# Altium schematic sheet PLC1_2.SchDoc
size 420 x 297 mm; SheetNumber: 2; Scale: {Масш.}; Title1str: {Наименование}; PageSetup: Record=PageOptions|CenterHorizontal=False|CenterVertical=False|PrintScale=0.70|XCorrection=0.00|YCorrection=0.00|PrintKind=1|BorderSize=5000000|LeftOffset=0|BottomOffset=0|Orientation=2|PaperLength=1000|PaperWidth=1000|Scale=100|PaperSource=7|PrintQuality=600|MediaType=1|DitherType=10|PrintScaleMode=1|PaperKind=A4; Title2str: {Наименование}; ProcessInspection: {Т.контр.}; Mass: {Масса}; NormInspection: {Н.контр.}; EngineerName: {Инженер}; Letter1Column: {}; Letter2Column: {}; Letter3Column: {}; DocumentType: ?????????????? ?????; DocumentType1str: {Документ}; DocumentType2str: {Документ}
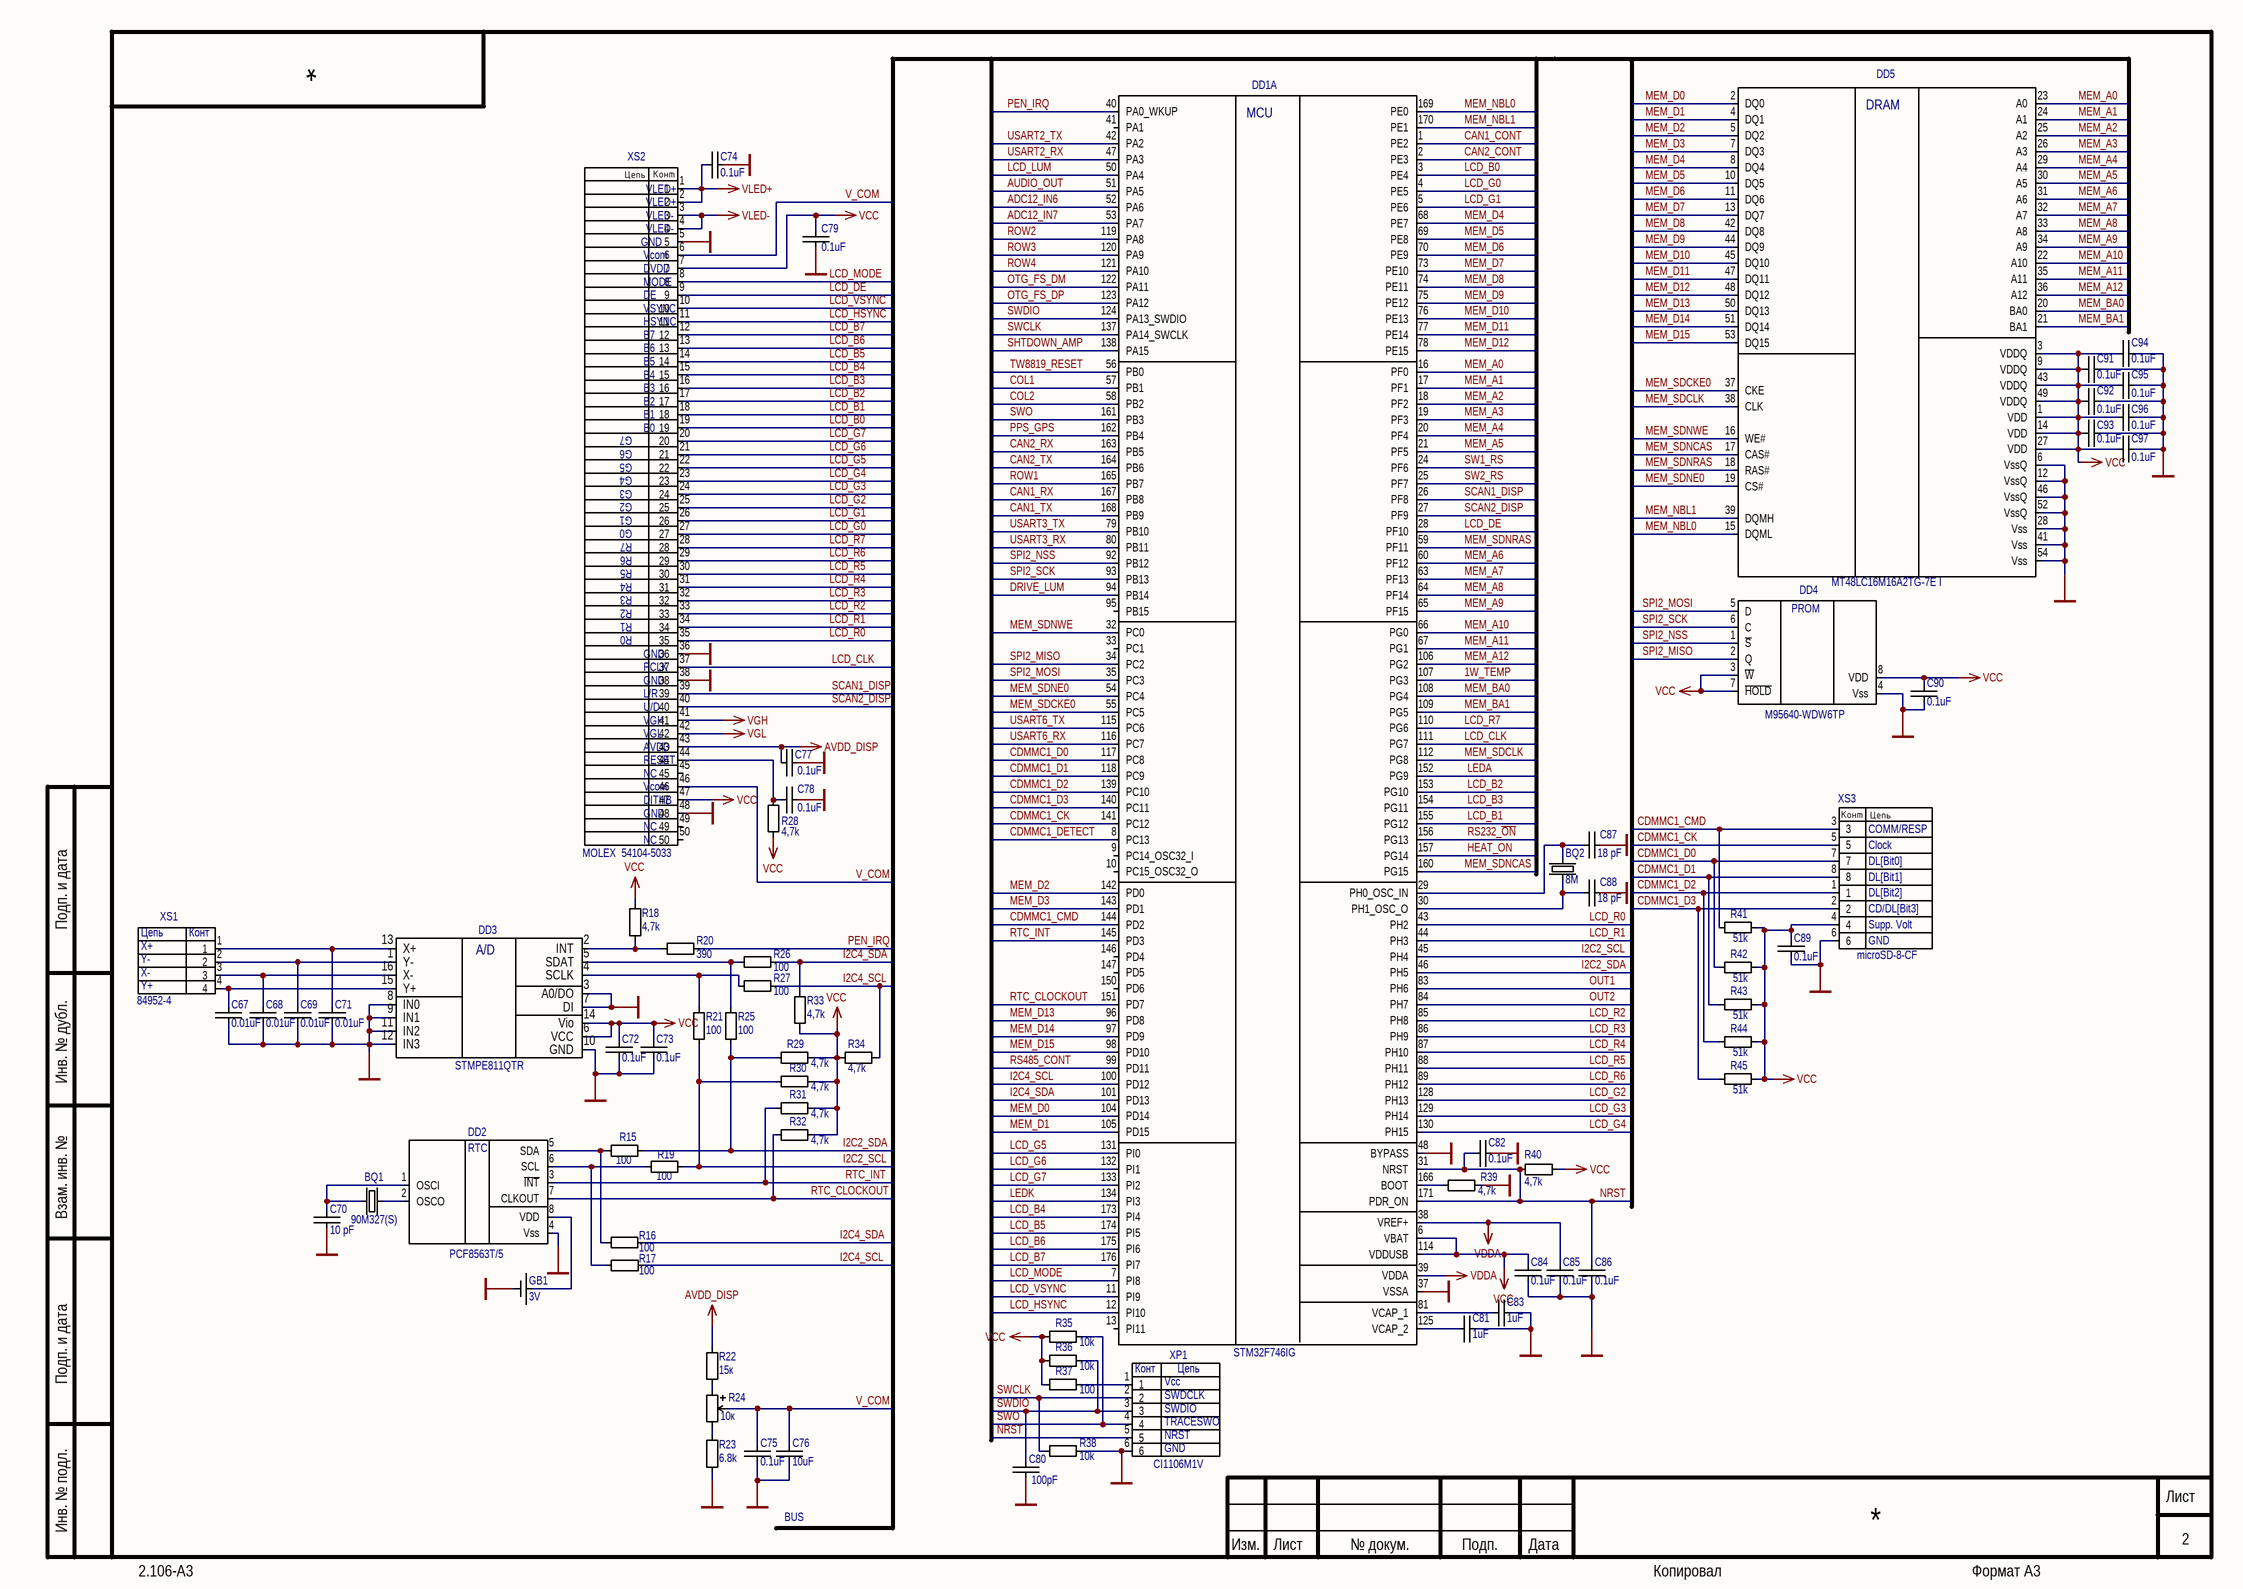
[diagram p0: PLC1_2.SchDoc]

## Parts
BQ1  Part Number: 90M327(S)  [90SMX]  (hidden comment: 90SMX 32768)
BQ2  value 8M  [TSX-3225]  (hidden comment: TSX-3225)
C67  0.01uF  [CAP_0603]
C68  0.01uF  [CAP_0603]
C69  0.01uF  [CAP_0603]
C70  value 10 pF  [CAP_0603]  (hidden comment: 10pF)
C71  0.01uF  [CAP_0603]
C72  0.1uF  [CAP_0603]
C73  0.1uF  [CAP_0603]
C74  0.1uF  [CAP_0603]
C75  0.1uF  [CAP_0603]
C76  value 10uF  [C_0805]  (hidden comment: Cap_0805)
C77  0.1uF  [CAP_0603]
C78  0.1uF  [CAP_0603]
C79  0.1uF  [CAP_0603]
C80  value 100pF  [CAP_0603]  (hidden comment: 100p)
C81  1uF  [CAP_0603]
C82  0.1uF  [CAP_0603]
C83  1uF  [CAP_0603]
C84  0.1uF  [CAP_0603]
C85  0.1uF  [CAP_0603]
C86  0.1uF  [CAP_0603]
C87  value 18 pF  [CAP_0603]  (hidden comment: 18pF)
C88  value 18 pF  [CAP_0603]  (hidden comment: 18pF)
C89  0.1uF  [CAP_0603]
C90  0.1uF  [CAP_0603]
C91  0.1uF  [CAP_0603]
C92  0.1uF  [CAP_0603]
C93  0.1uF  [CAP_0603]
C94  0.1uF  [CAP_0603]
C95  0.1uF  [CAP_0603]
C96  0.1uF  [CAP_0603]
C97  0.1uF  [CAP_0603]
DD1  Part Number: STM32F746IG  [F-QFP24x24-G176/N]  (hidden comment: STM32F746ZG_176)  (part A of 2)
DD2  Part Number: PCF8563T/5  [SOIC8]  (hidden comment: PCF8563_SOIC8)
DD3  STMPE811QTR  [QFN3X3-16]
DD4  Part Number: M95640-WDW6TP  [TSSO3x5-G8/X.4]  (hidden comment: M95640-WDW6TP_TSSOP-8)
DD5  Part Number: MT48LC16M16A2TG-7E I  [TSOP-54]  (hidden comment: MT48LC16M16A2TG)
GB1  3V  [Keystone-1066]
R15  value 100  [RES_0402]  (hidden comment: Res_0402)
R16  value 100  [RES_0402]  (hidden comment: Res_0402)
R17  value 100  [RES_0402]  (hidden comment: Res_0402)
R18  4,7k  [Res_0603]
R19  value 100  [RES_0402]  (hidden comment: Res_0402)
R20  390  [RES_0603]
R21  value 100  [RES_0402]  (hidden comment: Res_0402)
R22  15к  [RES_0603]
R23  6.8k  [RES_0603]
R24  value 10к  [3302X -3-103E]
R25  value 100  [RES_0402]  (hidden comment: Res_0402)
R26  value 100  [RES_0402]  (hidden comment: Res_0402)
R27  value 100  [RES_0402]  (hidden comment: Res_0402)
R28  4,7k  [Res_0603]
R29  4,7k  [Res_0603]
R30  4,7k  [Res_0603]
R31  4,7k  [Res_0603]
R32  4,7k  [Res_0603]
R33  4,7k  [Res_0603]
R34  4,7k  [Res_0603]
R35  10k  [RES_0603]
R36  10k  [RES_0603]
R37  value 100  [RES_0402]  (hidden comment: Res_0402)
R38  10k  [RES_0603]
R39  4,7k  [Res_0603]
R40  4,7k  [Res_0603]
R41  51k  [RES_0603]
R42  51k  [RES_0603]
R43  51k  [RES_0603]
R44  51k  [RES_0603]
R45  51k  [RES_0603]
XP1  value CI1106M1V  [CI1106М1V]
XS1  84952-4  [100ZFS-RL-04 Type2]
XS2  MOLEX  54104-5033  [FB0.5-50]
XS3  microSD-8-CF  [microSD-8-cf]

## Nets
AVDD_DISP: C77.1 R22.1 XS2.43
GND: C67.2 C68.2 C69.2 C70.1 C71.2 C72.1 C73.1 C74.1 C75.2 C76.1 C77.2 C78.2 C79.1 C80.2 C81.2 C82.2 C83.2 C84.2 C85.2 C86.2 C87.1 C88.1 C89.2 C90.2 C91.2 C92.1 C93.2 C94.2 C95.1 C96.2 C97.1 DD1.37(VSSA) DD1.48(BYPASS) DD2.4(Vss) DD3.3(A0/DO) DD3.7(DI) DD3.8(IN0) DD3.9(IN1) DD3.10(GND) DD3.11(IN2) DD3.12(IN3) DD4.4(Vss) DD5.6(VssQ) DD5.12(VssQ) DD5.28(Vss) DD5.41(Vss) DD5.46(VssQ) DD5.52(VssQ) DD5.54(Vss) GB1.1 R23.2 R38.1 R39.2 XP1.6 XS2.5 XS2.36 XS2.38 XS2.48 XS3.6
VCC: C72.2 C73.2 C79.2 C84.1 C89.1 C90.1 C91.1 C92.2 C93.1 C94.1 C95.2 C96.1 C97.2 DD1.6(VBAT) DD1.114(VDDUSB) DD3.6(VCC) DD3.14(Vio) DD4.3(~{W}) DD4.7(~{HOLD}) DD4.8(VDD) DD5.1(VDD) DD5.3(VDDQ) DD5.9(VDDQ) DD5.14(VDD) DD5.27(VDD) DD5.43(VDDQ) DD5.49(VDDQ) R18.2 R28.1 R29.2 R30.2 R31.2 R32.2 R33.2 R34.1 R35.2 R36.2 R37.2 R40.2 R41.1 R42.1 R43.1 R44.1 R45.1 XS2.7 XS2.47 XS3.4
VDDA: C85.1 DD1.38(VREF+) DD1.39(VDDA)
VGH: XS2.41
VGL: XS2.42
VLED+: C74.2 XS2.1 XS2.2
VLED-: XS2.3 XS2.4
1W_TEMP: DD1.107(PG3)
ADC12_IN6: DD1.52(PA6)
ADC12_IN7: DD1.53(PA7)
AUDIO_OUT: DD1.51(PA5)
CAN1_CONT: DD1.1(PE2)
CAN1_RX: DD1.167(PB8)
CAN1_TX: DD1.168(PB9)
CAN2_CONT: DD1.2(PE3)
CAN2_RX: DD1.163(PB5)
CAN2_TX: DD1.164(PB6)
CDMMC1_CK: DD1.141(PC12) XS3.5
CDMMC1_CMD: DD1.144(PD2) R41.2 XS3.3
CDMMC1_D0: DD1.117(PC8) R42.2 XS3.7
CDMMC1_D1: DD1.118(PC9) R43.2 XS3.8
CDMMC1_D2: DD1.139(PC10) R44.2 XS3.1
CDMMC1_D3: DD1.140(PC11) R45.2 XS3.2
CDMMC1_DETECT: DD1.8(PC13)
COL1: DD1.57(PB1)
COL2: DD1.58(PB2)
DRIVE_LUM: DD1.94(PB14)
HEAT_ON: DD1.157(PG14)
I2C2_SCL: DD1.45(PH4) R19.2 R21.2 R30.1
I2C2_SDA: DD1.46(PH5) R15.2 R25.2 R29.1
I2C4_SCL: DD1.100(PD12) R17.2 R27.2 R34.2
I2C4_SDA: DD1.101(PD13) R16.2 R26.2 R33.1
LCD_B0: DD1.3(PE4) XS2.19
LCD_B1: DD1.155(PG12) XS2.18
LCD_B2: DD1.153(PG10) XS2.17
LCD_B3: DD1.154(PG11) XS2.16
LCD_B4: DD1.173(PI4) XS2.15
LCD_B5: DD1.174(PI5) XS2.14
LCD_B6: DD1.175(PI6) XS2.13
LCD_B7: DD1.176(PI7) XS2.12
LCD_CLK: DD1.111(PG7) XS2.37
LCD_DE: DD1.28(PF10) XS2.9
LCD_G0: DD1.4(PE5) XS2.27
LCD_G1: DD1.5(PE6) XS2.26
LCD_G2: DD1.128(PH13) XS2.25
LCD_G3: DD1.129(PH14) XS2.24
LCD_G4: DD1.130(PH15) XS2.23
LCD_G5: DD1.131(PI0) XS2.22
LCD_G6: DD1.132(PI1) XS2.21
LCD_G7: DD1.133(PI2) XS2.20
LCD_HSYNC: DD1.12(PI10) XS2.11
LCD_LUM: DD1.50(PA4)
LCD_MODE: DD1.7(PI8) XS2.8
LCD_R0: DD1.43(PH2) XS2.35
LCD_R1: DD1.44(PH3) XS2.34
LCD_R2: DD1.85(PH8) XS2.33
LCD_R3: DD1.86(PH9) XS2.32
LCD_R4: DD1.87(PH10) XS2.31
LCD_R5: DD1.88(PH11) XS2.30
LCD_R6: DD1.89(PH12) XS2.29
LCD_R7: DD1.110(PG6) XS2.28
LCD_VSYNC: DD1.11(PI9) XS2.10
LEDA: DD1.152(PG9)
LEDK: DD1.134(PI3)
MEM_A0: DD1.16(PF0) DD5.23(A0)
MEM_A1: DD1.17(PF1) DD5.24(A1)
MEM_A2: DD1.18(PF2) DD5.25(A2)
MEM_A3: DD1.19(PF3) DD5.26(A3)
MEM_A4: DD1.20(PF4) DD5.29(A4)
MEM_A5: DD1.21(PF5) DD5.30(A5)
MEM_A6: DD1.60(PF12) DD5.31(A6)
MEM_A7: DD1.63(PF13) DD5.32(A7)
MEM_A8: DD1.64(PF14) DD5.33(A8)
MEM_A9: DD1.65(PF15) DD5.34(A9)
MEM_A10: DD1.66(PG0) DD5.22(A10)
MEM_A11: DD1.67(PG1) DD5.35(A11)
MEM_A12: DD1.106(PG2) DD5.36(A12)
MEM_BA0: DD1.108(PG4) DD5.20(BA0)
MEM_BA1: DD1.109(PG5) DD5.21(BA1)
MEM_D0: DD1.104(PD14) DD5.2(DQ0)
MEM_D1: DD1.105(PD15) DD5.4(DQ1)
MEM_D2: DD1.142(PD0) DD5.5(DQ2)
MEM_D3: DD1.143(PD1) DD5.7(DQ3)
MEM_D4: DD1.68(PE7) DD5.8(DQ4)
MEM_D5: DD1.69(PE8) DD5.10(DQ5)
MEM_D6: DD1.70(PE9) DD5.11(DQ6)
MEM_D7: DD1.73(PE10) DD5.13(DQ7)
MEM_D8: DD1.74(PE11) DD5.42(DQ8)
MEM_D9: DD1.75(PE12) DD5.44(DQ9)
MEM_D10: DD1.76(PE13) DD5.45(DQ10)
MEM_D11: DD1.77(PE14) DD5.47(DQ11)
MEM_D12: DD1.78(PE15) DD5.48(DQ12)
MEM_D13: DD1.96(PD8) DD5.50(DQ13)
MEM_D14: DD1.97(PD9) DD5.51(DQ14)
MEM_D15: DD1.98(PD10) DD5.53(DQ15)
MEM_NBL0: DD1.169(PE0) DD5.15(DQML)
MEM_NBL1: DD1.170(PE1) DD5.39(DQMH)
MEM_SDCKE0: DD1.55(PC5) DD5.37(CKE)
MEM_SDCLK: DD1.112(PG8) DD5.38(CLK)
MEM_SDNCAS: DD1.160(PG15) DD5.17(CAS#)
MEM_SDNE0: DD1.54(PC4) DD5.19(CS#)
MEM_SDNRAS: DD1.59(PF11) DD5.18(RAS#)
MEM_SDNWE: DD1.32(PC0) DD5.16(WE#)
NRST: C82.1 C86.1 DD1.31(NRST) DD1.171(PDR_ON) R40.1 XP1.5
OTG_FS_DM: DD1.122(PA11)
OTG_FS_DP: DD1.123(PA12)
OUT1: DD1.83(PH6)
OUT2: DD1.84(PH7)
PEN_IRQ: DD1.40(PA0_WKUP) R20.2
PPS_GPS: DD1.162(PB4)
ROW1: DD1.165(PB7)
ROW2: DD1.119(PA8)
ROW3: DD1.120(PA9)
ROW4: DD1.121(PA10)
RS232_~{ON}: DD1.156(PG13)
RS485_CONT: DD1.99(PD11)
RTC_CLOCKOUT: DD1.151(PD7) DD2.7(CLKOUT) R32.1
RTC_INT: DD1.145(PD3) DD2.3(~{INT}) R31.1
SCAN1_DISP: DD1.26(PF8) XS2.39
SCAN2_DISP: DD1.27(PF9) XS2.40
SHTDOWN_AMP: DD1.138(PA15)
SPI2_MISO: DD1.34(PC2) DD4.2(Q)
SPI2_MOSI: DD1.35(PC3) DD4.5(D)
SPI2_NSS: DD1.92(PB12) DD4.1(~{S})
SPI2_SCK: DD1.93(PB13) DD4.6(C)
SW1_RS: DD1.24(PF6)
SW2_RS: DD1.25(PF7)
SWCLK: DD1.137(PA14_SWCLK) R38.2 XP1.2
SWDIO: C80.1 DD1.124(PA13_SWDIO) R36.1 XP1.3
SWO: DD1.161(PB3) R35.1 XP1.4
TW8819_RESET: DD1.56(PB0)
USART2_RX: DD1.47(PA3)
USART2_TX: DD1.42(PA2)
USART3_RX: DD1.80(PB11)
USART3_TX: DD1.79(PB10)
USART6_RX: DD1.116(PC7)
USART6_TX: DD1.115(PC6)
V_COM: C75.1 C76.2 R24.2 XS2.6 XS2.46
NetBQ1_1: BQ1.1 C70.2 DD2.1(OSCI)
NetBQ1_2: BQ1.2 DD2.2(OSCO)
NetBQ2_1: BQ2.1 C88.2 DD1.30(PH1_OSC_O)
NetBQ2_2: BQ2.2 C87.2 DD1.29(PH0_OSC_IN)
NetC67_1: C67.1 DD3.15(Y+) XS1.4
NetC68_1: C68.1 DD3.16(X-) XS1.3
NetC69_1: C69.1 DD3.1(Y-) XS1.2
NetC71_1: C71.1 DD3.13(X+) XS1.1
NetC78_1: C78.1 R28.2 XS2.44
NetC81_1: C81.1 DD1.125(VCAP_2)
NetC83_1: C83.1 DD1.81(VCAP_1)
NetDD1_166: DD1.166(BOOT) R39.1
NetDD2_5: DD2.5(SDA) R15.1 R16.1
NetDD2_6: DD2.6(SCL) R17.1 R19.1
NetDD2_8: DD2.8(VDD) GB1.2
NetDD3_2: DD3.2(INT) R18.1 R20.1
NetDD3_4: DD3.4(SCLK) R21.1 R27.1
NetDD3_5: DD3.5(SDAT) R25.1 R26.1
NetR22_2: R22.2 R24.3
NetR23_1: R23.1 R24.1
NetR37_1: R37.1 XP1.1

Not connected (* = marked no-connect by the designer): DD1 9(PC14_OSC32_I) 10(PC15_OSC32_O) 13(PI11) 33(PC1) 41(PA1) 95(PB15) 146(PD4) 147(PD5) 150(PD6); XS2 45 49 50

## Notes on the sheet
- (near XS2) VLED+
- (near XS2) GND
- (near XS2) Vcom
- (near XS2) VLED-
- (near XS2) DVDD
- (near XS2) B7
- (near XS2) HSYNC
- (near XS2) VSYNC
- (near XS2) MODE
- (near XS2) DE
- (near XS2) B2
- (near XS2) B3
- (near XS2) B4
- (near XS2) B5
- (near XS2) B6
- (near XS2) G5
- (near XS2) G6
- (near XS2) G7
- (near XS2) B0
- (near XS2) B1
- (near XS2) G0
- (near XS2) G1
- (near XS2) G2
- (near XS2) G3
- (near XS2) G4
- (near XS2) R3
- (near XS2) R4
- (near XS2) R5
- (near XS2) R6
- (near XS2) R7
- (near XS2) R0
- (near XS2) R1
- (near XS2) R2
- (near XS2) PCLK
- (near XS2) L/R
- (near XS2) U/D
- (near XS2) VGH
- (near XS2) VGL
- (near XS2) AVDD
- (near XS2) RESET
- (near XS2) NC
- (near XS2) DITHB
- (near XS1) Цепь
- (near XS1) Конт
- X+
- Y-
- X-
- Y+
- Vcc
- (near XP1) SWDCLK
- (near XP1) SWDIO
- (near XP1) TRACESWO
- (near XP1) NRST
- (near XP1) GND
- BUS
- Подп. и дата
- Инв. № дубл.
- Взам. инв. №
- Инв. № подл.
- Изм.
- Лист
- № докум.
- Подп.
- Дата
- 2.106-A3
- Копировал
- Формат А3
- (in symbol M95640) PROM
- (in symbol microSD-8-CF) COMM/RESP; Clock; DL[Bit0]; DL[Bit1]; DL[Bit2]; CD/DL[Bit3]; Supp. Volt; GND
- (in symbol PCF8563_SOIC8) RTC
- (in symbol STMPE811QTR) A/D
- (in symbol СI1106М1V) Конт; Цепь

## Library data of the parts
BQ1 = 90SMX 32768: Manufacturer: QCU; Replacement: ABS25-32.768KHZ-T; PackageReference: 90SMX
BQ2 = TSX-3225: Manufacturer: EPSON; Replacement: TSX-3225 8.0000MF20X-AJ0-ND; PackageReference: TSX-3225; Part Number: TSX-3225 8.0000MF20X-AJ0-ND
C67-C69 C71 = Cap_0603: Manufacturer: AVX; Part Number: 0603YC103KAT2A; Replacement: GRM188R71E103KA12D; PackageReference: 0603; Value: 0.01uF; Distributor: http://www.rospek.ru; Price: 0.001$
C70 = Cap_0603: Manufacturer: Yageo; Part Number: CC0603JRNPO9BN100; Replacement: 10pF 0603 NP0; PackageReference: 0603; Distributor: http://www.platan.ru/; Price: 0.02$
C72 C73 = Cap_0603: 16V 0.1uF 10% X7R; Manufacturer: AVX; Part Number: 0603YC104KAT2A; Replacement: 0.1uF 16V X7R 10% 0603; PackageReference: 0603; Value: 0.1uF; Distributor: http://www.rospek.ru; Price: 0.001$
C74 C75 C77-C79 C82 C84-C86 C89-C97 = Cap_0603: Manufacturer: AVX; Part Number: 0603YC104KAT2A; Replacement: GRM188R71E104KA12D; PackageReference: 0603; Value: 0.1uF; Distributor: http://www.rospek.ru; Price: 0.001$
C76 = Cap_0805: Manufacturer: Murata; Part Number: GRM21BR61E106KA73L; Replacement: 0805 16V X7R; PackageReference: 0805; Distributor: http://www.rospek.ru; Price: 0.01$
C80 = Cap_0603: Manufacturer: Yageo; Part Number: CC0603JRNPO9BN101; Replacement: 100pF 0603 NP0; PackageReference: 0603; Distributor: http://www.platan.ru/; Price: 0.02$
C81 = Cap_0603: Manufacturer: AVX; Part Number: 0603YC105KAT2A; Replacement: 0603YD105KAT2A; PackageReference: 0603; Value: 1uF; Distributor: http://www.rospek.ru; Price: 0.001$
C83 = Cap_0603: Manufacturer: AVX; Replacement: 0603YD105KAT2A; PackageReference: 0603; Part Number: 0603YD105KAT2A; Value: 1uF; Distributor: http://www.rospek.ru; Price: 0.001$
C87 C88 = Cap_0603: Manufacturer: Murata; Part Number: GRM1885C1H180JA01D; Replacement: 18pF 0603 NP0; PackageReference: 0603; Distributor: http://www.rospek.ru; Price: 0.001$
DD1 = STM32F746ZG_176: MCU; Manufacturer: ST; Price: 0; Distributor: mouser; Replacement: STM32F746; PackageReference: LQFP144
DD2 = PCF8563_SOIC8: Manufacturer: NXP; Price: 0.3$; Replacement: PCF8563T/5; PackageReference: SO-8
DD3 = STMPE811QTR: Touchscreen controller; Manufacturer: S T; Price: 1$; Replacement: STMPE811QTR; PackageReference: QFN-16; Part Number: STMPE811QTR
DD4 = M95640: Manufacturer: ST; Replacement: M95640-RDW6TP; Price: 0.25$; Distributor: http://st.com; PackageReference: TSSOP-8
DD5 = MT48LC16M16A2TG: DRAM; Manufacturer: ST; Replacement: MT48LC16M16A2P-7E I; Price: 1$; Distributor: mouser; PackageReference: TSOP-54
GB1 = Battery_3V: Keystone - 1066; Part Number: Keystone - 1066; Price: 0.3$
R15-R17 R19 R21 R25-R27 R37 = Res_0402: 0402; Manufacturer: BOURNS; Part Number: CR0402-FX-1000GLF; Replacement: 0402 100 Ohm 5%; PackageReference: 0402; Distributor: http://www.kontest.ru; Price: 0.01$
R18 R28-R34 R39 R40 = Res_0603: 0603, 100; Manufacturer: Vishay; Part Number: CRCW0603-472JRT1; Replacement: 0603 4.7 kOhm 5%; PackageReference: 0603; Value: 4,7k; Distributor: http://www.kontest.ru; Price: 0.01$
R20 = Res_0603: 0603, 390; Manufacturer: YAGEO; Part Number: RC0603FR-07390RL; Replacement: 0603 390 5%; PackageReference: 0603; Value: 390; Price: 0.004$
R22 = Res_0603: 0603, 15k; Manufacturer: Vishay; Part Number: CRCW060315K0JNTA; Replacement: 0603 15 kOhm 5%; PackageReference: 0603; Distributor: http://www.kontest.ru; Price: 0.01$; Value: 15к
R23 = Res_0603: 0603, 6.8k; Manufacturer: Vishay; Part Number: CRCW06036K80JNEA; Replacement: 0603 6.8 kOhm 5%; Value: 6.8к; PackageReference: 0603; Distributor: http://www.kontest.ru; Price: 0.01$
R24 = 3302X-3-103E: Manufacturer: Bourns; Part Number: 3302X-3-103E; Price: 0.42$
R35 R36 R38 = Res_0603: 0603, 10k; Manufacturer: Vishay; Part Number: CRCW060310K0JNE; Replacement: 0603 10 kOhm 5%; PackageReference: 0603; Distributor: http://www.kontest.ru; Price: 0.01$; Value: 10k
R41-R45 = Res_0603: 0603, 51k; Manufacturer: Vishay; Part Number: CRCW0603-513JRT1; Replacement: 0603 51 kOhm 5%; PackageReference: 0603; Distributor: http://www.kontest.ru; Price: 0.01$
XP1 = СI1106М1V: CON 6pin СI1106М1V Гнездо Розетка; Montage: SMD; Contacts: 6; Contact_type: plug; Family: Connectror; Type: plug
XS1 = 100ZFS-RL-04: Manufacturer: RTC, TE; Value: 84952-4; Part Number: 84952-4; Replacement: 84952-4
XS2 = FB0.5-50: Manufacturer: RCT; Price: 1$; Part Number: MOLEX 	54104-5033; Replacement: MOLEX 	54104-5033; PackageReference: SMD-50
XS3 = microSD-8-CF: Part Number: microSD 8-CF; Replacement: microSD-8-CF; Price: 1$